# EAGLE design ECG (EAGLE 9.4.2)
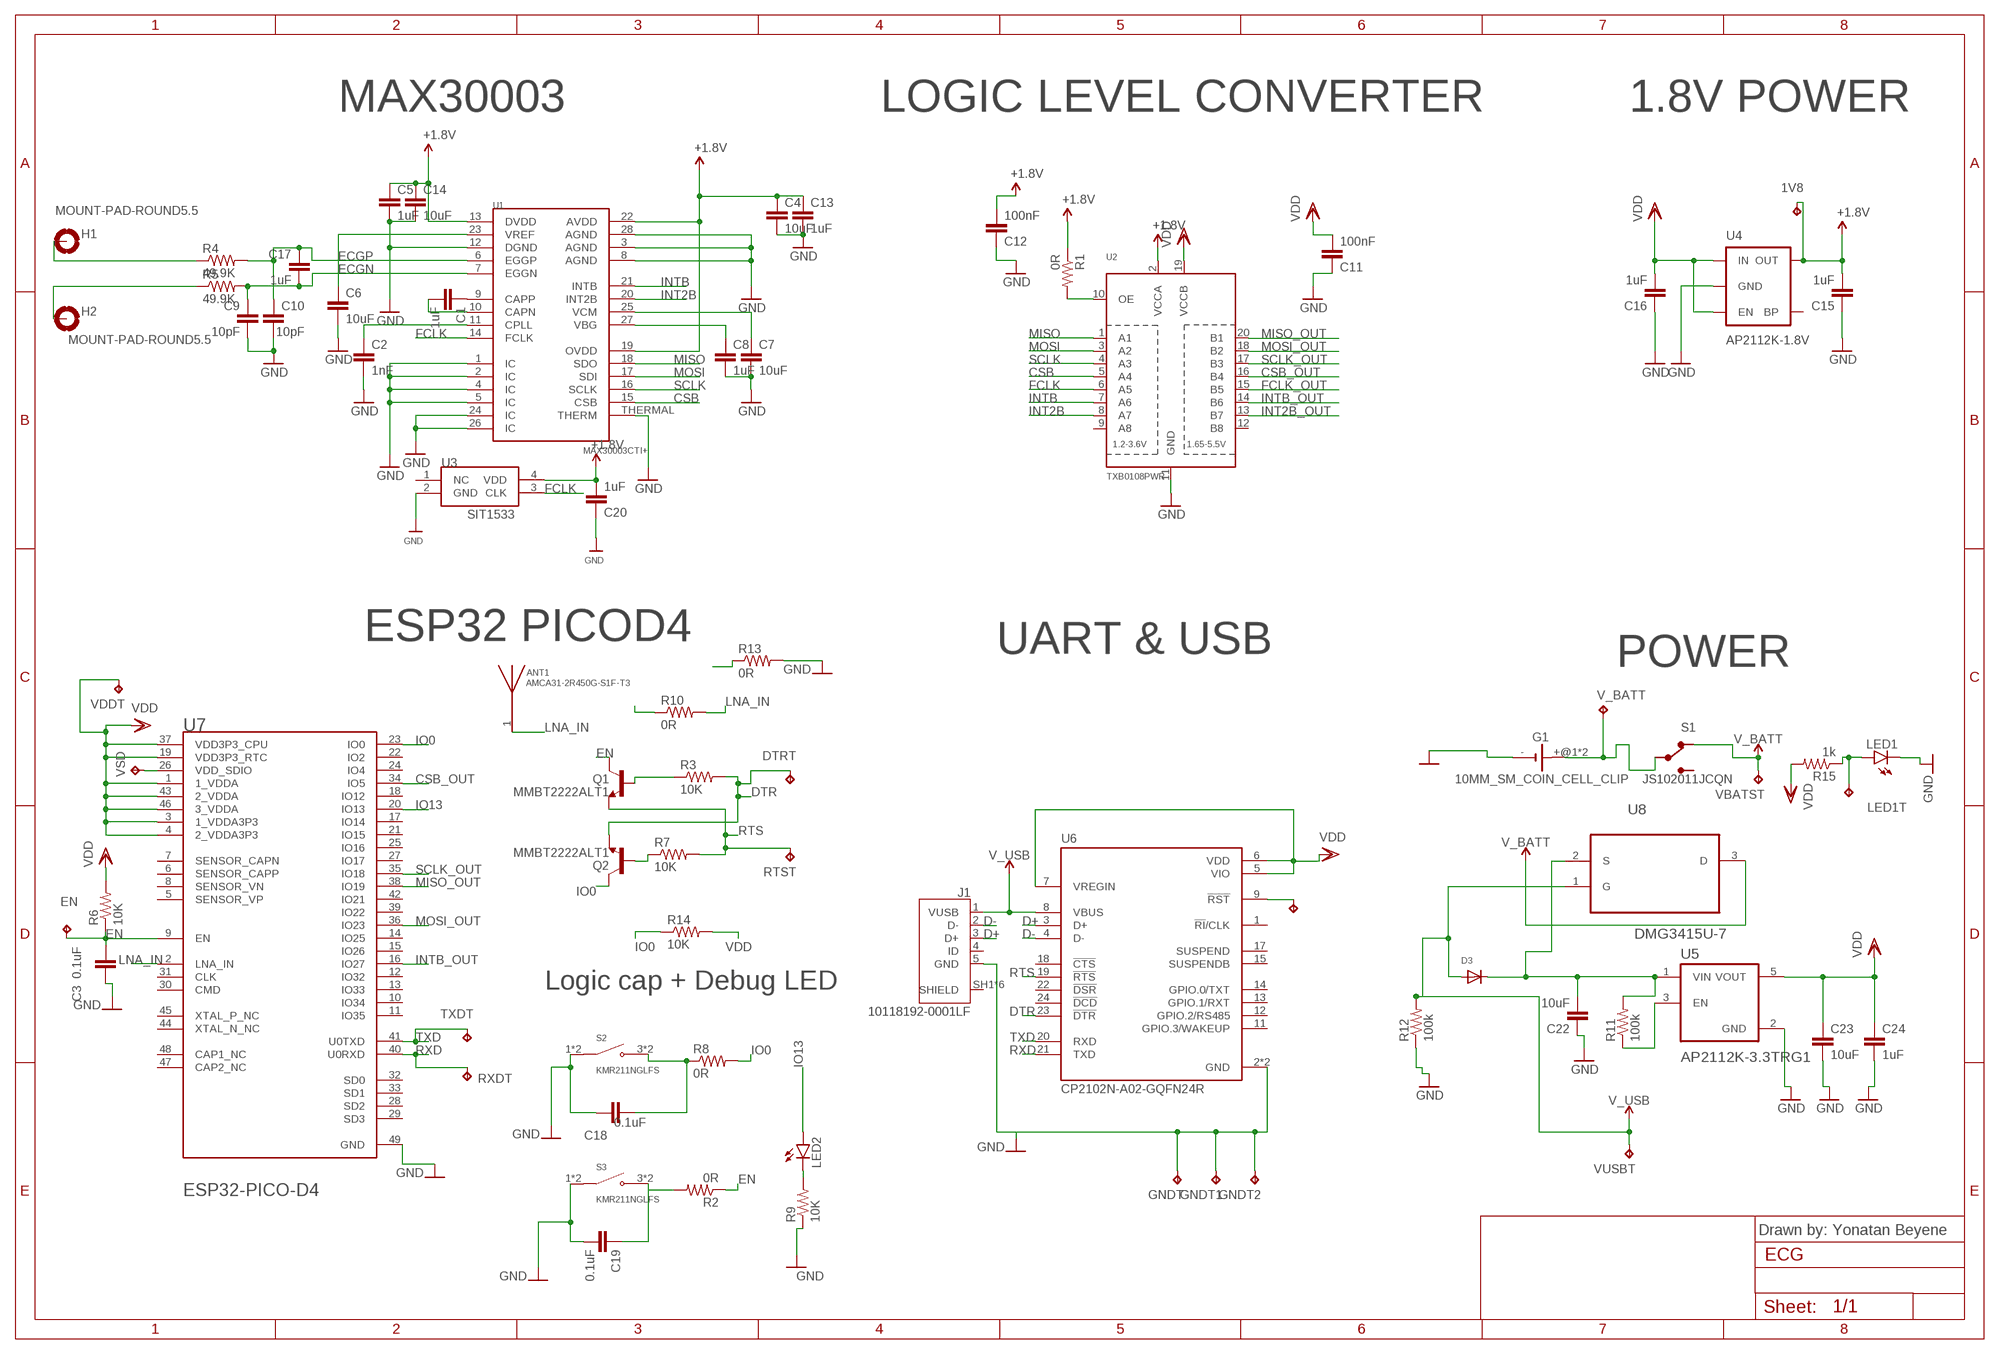
[diagram p0: schematic, sheet 1]

## Parts
1V8  TPTP12SQ  [TP12SQ]
ANT1  AMCA31-2R450G-S1F-T3  [ANT_AMCA31-2R450G-S1F-T3]
C1  1uF  C-EUC0805  [C0805]
C2  1nF  C-EUC0805  [C0805]
C3  0.1uF  C-EUC0805  [C0805]
C4  10uF  C-EUC0805  [C0805]
C5  1uF  C-EUC0805  [C0805]
C6  10uF  C-EUC0805  [C0805]
C7  10uF  C-EUC0805  [C0805]
C8  1uF  C-EUC0805  [C0805]
C9  10pF  C-EUC0805  [C0805]
C10  10pF  C-EUC0805  [C0805]
C11  100nF  C-EUC0805  [C0805]
C12  100nF  C-EUC0805  [C0805]
C13  1uF  C-EUC0805  [C0805]
C14  10uF  C-EUC0805  [C0805]
C15  1uF  C-EUC0805  [C0805]
C16  1uF  C-EUC0805  [C0805]
C17  1uF  C-EUC0805  [C0805]
C18  0.1uF  C-EUC0805  [C0805]
C19  0.1uF  C-EUC0805  [C0805]
C20  1uF  C-EUC0805  [C0805]
C22  10uF  C-EUC0805  [C0805]
C23  10uF  C-EUC0805  [C0805]
C24  1uF  C-EUC0805  [C0805]
D3  DIODE_SOD-123FL  [SOD-123FL]
DTRT  TPTP12SQ  [TP12SQ]
EN  TPTP12SQ  [TP12SQ]
G1  10MM_SM_COIN_CELL_CLIP  [10MM_SM_COIN_CELL_CLIP]
GNDT  TPTP12SQ  [TP12SQ]
GNDT1  TPTP12SQ  [TP12SQ]
GNDT2  TPTP12SQ  [TP12SQ]
H1  MOUNT-PAD-ROUND5.5  [5,5-PAD]
H2  MOUNT-PAD-ROUND5.5  [5,5-PAD]
J1  10118192-0001LF  [AMPHENOL_10118192-0001LF]
LED1  LEDSML0805  [SML0805]
LED1T  TPTP12SQ  [TP12SQ]
LED2  LEDSML0805  [SML0805]
Q1  MMBT2222ALT1  [SOT95P237X111-3N]
Q2  MMBT2222ALT1  [SOT95P237X111-3N]
R1  0R  RESISTOR0805-RES  [0805]
R2  0R  RESISTOR0805-RES  [0805]
R3  10K  RESISTOR0805-RES  [0805]
R4  49.9K  RESISTOR0805-RES  [0805]
R5  49.9K  RESISTOR0805-RES  [0805]
R6  10K  RESISTOR0805-RES  [0805]
R7  10K  RESISTOR0805-RES  [0805]
R8  0R  RESISTOR0805-RES  [0805]
R9  10K  RESISTOR0805-RES  [0805]
R10  0R  RESISTOR0805-RES  [0805]
R11  100k  RESISTOR0805-RES  [0805]
R12  100k  RESISTOR0805-RES  [0805]
R13  0R  RESISTOR0805-RES  [0805]
R14  10K  RESISTOR0805-RES  [0805]
R15  1k  RESISTOR0805-RES  [0805]
RTST  TPTP12SQ  [TP12SQ]
RXDT  TPTP12SQ  [TP12SQ]
S1  JS102011JCQN  [SW_JS102011JCQN]
S2  KMR211NGLFS  [SW_KMR211NGLFS]
S3  KMR211NGLFS  [SW_KMR211NGLFS]
TXDT  TPTP12SQ  [TP12SQ]
U1  MAX30003CTI+  MAX30003  [QFN-28]
U2  TXB0108PWR  [TSSOP20]
U3  SIT1533  [SIT1533]
U4  AP2112K-1.8V  V_REG_LDOSMD  [SOT23-5]
U5  AP2112K-3.3TRG1  [SOT95P285X140-5N]
U6  CP2102N-A02-GQFN24R  [QFN50P400X400X80-25N]
U7  ESPRESSIF_SYSTEMS_ESP32-PICO-D4ESPRESSIF_SYSTEMS_ESP32-PICO-D4_0_0  [ESPRESSIF_SYSTEMS_ESP32-PICO-D4_0]
U8  DMG3415U-7  [SOT95P240X105-3N]
URSTT  TPTP12SQ  [TP12SQ]
V_BATT  TPTP12SQ  [TP12SQ]
VBATST  TPTP12SQ  [TP12SQ]
VDDT  TPTP12SQ  [TP12SQ]
VSD  TPTP12SQ  [TP12SQ]
VUSBT  TPTP12SQ  [TP12SQ]

## Nets
+1.8V: 1V8.TP C4.1 C5.1 C12.2 C13.1 C14.1 C15.2 C20.2 R1.1 U1.13(DVDD) U1.19(OVDD) U1.22(AVDD) U2.2(VCCA) U3.4(VDD) U4.5(OUT)
CSB: U1.15(CSB) U2.5(A4)
CSB_OUT: U2.16(B4) U7.34(IO5)
D+: J1.3(D+) U6.3(D+)
D-: J1.2(D-) U6.4(D-)
DTR: DTRT.TP Q2.2(E) R3.2 U6.23(!DTR)
ECGN: C9.1 C17.2 R5.2 U1.7(EGGN)
ECGP: C10.1 C17.1 R4.2 U1.6(EGGP)
EN: C3.2 EN.TP Q1.3(C) R2.1 R6.1 U7.9(EN)
FCLK: U1.14(FCLK) U2.6(A5) U3.3(CLK)
FCLK_OUT: U2.15(B5)
GND: C2.2 C3.1 C4.2 C5.2 C6.2 C7.2 C8.2 C9.2 C10.2 C11.1 C12.1 C13.2 C14.2 C15.1 C16.1 C18.1 C19.2 C20.1 C22.1 C23.2 C24.2 G1.- GNDT1.TP GNDT2.TP GNDT.TP J1.5(GND) LED1.C R9.1 R12.1 R13.2 S2.1(COM) S2.2(COM) S3.1(COM) S3.2(COM) U1.1(IC) U1.2(IC) U1.3(AGND) U1.4(IC) U1.5(IC) U1.8(AGND) U1.12(DGND) U1.24(IC) U1.26(IC) U1.28(AGND) U1.THERMAL(THERM) U2.11(GND) U3.2(GND) U4.2(GND) U5.2(GND) U6.2(GND) U6.25(GND) U7.49(GND)
INT2B: U1.20(INT2B) U2.8(A7)
INT2B_OUT: U2.13(B7)
INTB: U1.21(INTB) U2.7(A6)
INTB_OUT: U2.14(B6) U7.16(IO27)
IO0: Q2.3(C) R8.2 R14.1 U7.23(IO0)
IO13: LED2.A U7.20(IO13)
LNA_IN: ANT1.1 R10.2 U7.2(LNA_IN)
MISO: U1.18(SDO) U2.1(A1)
MISO_OUT: U2.20(B1) U7.38(IO19)
MOSI: U1.17(SDI) U2.3(A2)
MOSI_OUT: U2.18(B2) U7.36(IO23)
N$1: H1.B5,5(MOUNT) R4.1
N$2: C6.1 U1.23(VREF)
N$3: C1.1 U1.9(CAPP)
N$4: H2.B5,5(MOUNT) R5.1
N$5: R1.2 U2.10(OE)
N$6: C1.2 U1.10(CAPN)
N$7: C2.1 U1.11(CPLL)
N$8: Q1.1(B) R3.1
N$9: U7.26(VDD_SDIO) VSD.TP
N$11: Q2.1(B) R7.1
N$12: R10.1
N$13: C18.2 R8.1 S2.3(NO) S2.4(NO)
N$14: C8.1 U1.27(VBG)
N$15: LED2.C R9.2
N$16: LED1.A LED1T.TP R15.1
N$17: U6.9(!RST) URSTT.TP
N$18: C19.1 R2.2 S3.3(NO) S3.4(NO)
N$20: R13.1
N$21: G1.+@1(+) G1.+@2(+) S1.2 V_BATT.TP
N$25: R11.1 U5.3(EN)
N$26: C22.2 D3.C R11.2 U5.1(VIN) U8.2(S)
RTS: Q1.2(E) R7.2 RTST.TP U6.19(!RTS)
RXD: RXDT.TP U6.21(TXD) U7.40(U0RXD)
SCLK: U1.16(SCLK) U2.4(A3)
SCLK_OUT: U2.17(B3) U7.35(IO18)
TXD: TXDT.TP U6.20(RXD) U7.41(U0TXD)
V_BATT: S1.1 U8.3(D) VBATST.TP
V_USB: D3.A J1.1(VUSB) R12.2 U6.8(VBUS) U8.1(G) VUSBT.TP
VCM: C7.1 U1.25(VCM)
VDD: C11.2 C16.2 C23.1 C24.1 R6.2 R14.2 R15.2 U2.19(VCCB) U4.1(IN) U4.3(EN) U5.5(VOUT) U6.5(VIO) U6.6(VDD) U6.7(VREGIN) U7.1(1_VDDA) U7.3(1_VDDA3P3) U7.4(2_VDDA3P3) U7.19(VDD3P3_RTC) U7.37(VDD3P3_CPU) U7.43(2_VDDA) U7.46(3_VDDA) VDDT.TP
Unconnected: J1.4(ID) J1.SH1(SHIELD) J1.SH2(SHIELD) J1.SH3(SHIELD) J1.SH4(SHIELD) J1.SH5(SHIELD) J1.SH6(SHIELD) S1.3 U2.9(A8) U2.12(B8) U3.1(NC) U4.4(BP) U6.1(!RI!/CLK) U6.11(GPIO.3/WAKEUP) U6.12(GPIO.2/RS485) U6.13(GPIO.1/RXT) U6.14(GPIO.0/TXT) U6.15(SUSPENDB) U6.17(SUSPEND) U6.18(!CTS) U6.22(!DSR) U6.24(!DCD) U7.5(SENSOR_VP) U7.6(SENSOR_CAPP) U7.7(SENSOR_CAPN) U7.8(SENSOR_VN) U7.10(IO34) U7.11(IO35) U7.12(IO32) U7.13(IO33) U7.14(IO25) U7.15(IO26) U7.17(IO14) U7.18(IO12) U7.21(IO15) U7.22(IO2) U7.24(IO4) U7.25(IO16) U7.27(IO17) U7.28(SD2) U7.29(SD3) U7.30(CMD) U7.31(CLK) U7.32(SD0) U7.33(SD1) U7.39(IO22) U7.42(IO21) U7.44(XTAL_N_NC) U7.45(XTAL_P_NC) U7.47(CAP2_NC) U7.48(CAP1_NC)

## Notes on the sheet
- MAX30003 | LOGIC LEVEL CONVERTER | 1.8V POWER
- ESP32 PICOD4 | UART & USB
- POWER
- Logic cap + Debug LED
- Drawn by: Yonatan Beyene

## Library data of the parts
1V8 DTRT EN GNDT GNDT1 GNDT2 LED1T RTST RXDT TXDT URSTT V_BATT VBATST VDDT VSD VUSBT = testpad:TP: Test pad
ANT1 = AMCA31-2R450G-S1F-T3:AMCA31-2R450G-S1F-T3: Surface Mount WLAN / Bluetooth Chip Antenna (2450MHz) Check prices <https://pricing.snapeda.com/parts/AMCA31-2R450G-S1F-T3/Abracon%20LLC/view-part?ref=eda>; AVAILABILITY: Good; DESCRIPTION: 2.4GHz Bluetooth, Wi-Fi, WLAN Chip RF Antenna 2.405GHz ~ 2.495GHz 0.5dBi Solder Surface Mount; MF: Abracon LLC; MP: AMCA31-2R450G-S1F-T3; PACKAGE: None; PRICE: None; PURCHASE-URL: https://pricing.snapeda.com/search/part/AMCA31-2R450G-S1F-T3/?ref=eda
C1 C2 C4-C17 C20 = rcl:C-EU: CAPACITOR, European symbol; SPICEPREFIX: C
C3 C18 C19 C22-C24 = rcl:C-EU: CAPACITOR, European symbol
D3 = adafruit:DIODE: Diode SMADIODE - SMA Surface Mount Package 20V 1A Schottky Diode Digikey: 641-1014-6-ND DO-1N4148 - Through Hole Small Current Diode SOD-123 20V 1 A (.5mV Vf) Schottky Diode - Digikey: MBRX120TPMSCT-ND SOD-323 10V 570mA (.38mV Vf, 3ns) Schottky Diode - Digikey: ZLLS410CT-ND SOD-523 30V 30mA Schottky Diode (RB751S-40TE61) - Digikey: RB751S-40TE61CT-ND SOT23-R/W - SOT23 Package (R = Solder Paste/Reflow Ovens, W = Hand-Soldering) BAT54Film 40V 300mA - Digikey: 497-7162-1-ND
G1 = battery:10MM_SM_COIN_CELL_CLIP: Battery cell clip for CR927 Source: KEYSTONE ELECTRONICS CORP. www.keyelco.com, ASTORIA, N.Y. 11105-2017 PART ANME 10mm SM COIN CELl CLIP DWG NO. 3030
H1 H2 = holes:MOUNT-PAD-ROUND: MOUNTING PAD, round
J1 = 10118192-0001LF:10118192-0001LF: Single Port 5 Contact Horizontal Right Angle Shielded Micro B USB 2.0 Connector Check prices <https://pricing.snapeda.com/parts/10118192-0001LF/Amphenol%20ICC%20%28FCI%29/view-part?ref=eda>; AVAILABILITY: Good; DESCRIPTION: USB - micro B USB 2.0 Receptacle Connector 5 Position Surface Mount, Right Angle; MF: Amphenol ICC (FCI); MP: 10118192-0001LF; PACKAGE: None; PRICE: None; PURCHASE-URL: https://pricing.snapeda.com/search/part/10118192-0001LF/?ref=eda
LED1 LED2 = led:LED: LED OSRAM: - CHIPLED LG R971, LG N971, LY N971, LG Q971, LY Q971, LO R971, LY R971 LH N974, LH R974 LS Q976, LO Q976, LY Q976 LO Q996 - Hyper CHIPLED LW Q18S LB Q993, LB Q99A, LB R99A - SideLED LS A670, LO A670, LY A670, LG A670, LP A670 LB A673, LV A673, LT A673, LW A673 LH A674 LY A675 LS A676, LA A676, LO A676, LY A676, LW A676 LS A679, LY A679, LG A679 - Hyper Micro SIDELED® LS Y876, LA Y876, LO Y876, LY Y876 LT Y87S - SmartLED LW L88C, LW L88S LB L89C, LB L89S, LG L890 LS L89K, LO L89K, LY L89K LS L896, LA L896, LO L896, LY L896 - TOPLED LS T670, LO T670, LY T670, LG T670, LP T670 LSG T670, LSP T670, LSY T670, LOP T670, LYG T670 LG T671, LOG T671, LSG T671 LB T673, LV T673, LT T673, LW T673 LH T674 LS T676, LA T676, LO T676, LY T676, LB T676, LH T676, LSB T676, LW T676 LB T67C, LV T67C, LT T67C, LS T67K, LO T67K, LY T67K, LW E67C LS E67B, LA E67B, LO E67B, LY E67B, LB E67C, LV E67C, LT E67C LW T67C LS T679, LY T679, LG T679 LS T770, LO T770, LY T770, LG T770, LP T770 LB T773, LV T773, LT T773, LW T773 LH T774 LS E675, LA E675, LY E675, LS T675 LS T776, LA T776, LO T776, LY T776, LB T776 LHGB T686 LT T68C, LB T68C - Hyper Mini TOPLED® LB M676 - Mini TOPLED Santana® LG M470 LS M47K, LO M47K, LY M47K Source: http://www.osram.convergy.de LUXEON: - LUMILED® LXK2-PW12-R00, LXK2-PW12-S00, LXK2-PW14-U00, LXK2-PW14-V00 LXK2-PM12-R00, LXK2-PM12-S00, LXK2-PM14-U00 LXK2-PE12-Q00, LXK2-PE12-R00, LXK2-PE12-S00, LXK2-PE14-T00, LXK2-PE14-U00 LXK2-PB12-K00, LXK2-PB12-L00, LXK2-PB12-M00, LXK2-PB14-N00, LXK2-PB14-P00, LXK2-PB14-Q00 LXK2-PR12-L00, LXK2-PR12-M00, LXK2-PR14-Q00, LXK2-PR14-R00 LXK2-PD12-Q00, LXK2-PD12-R00, LXK2-PD12-S00 LXK2-PH12-R00, LXK2-PH12-S00 LXK2-PL12-P00, LXK2-PL12-Q00, LXK2-PL12-R00 Source: www.luxeon.com KINGBRIGHT: KA-3528ASYC Source: www.kingbright.com
Q1 Q2 = MMBT2222ALT1:MMBT2222ALT1: Trans NPN 40V 0.6A SOT23; AVAILABILITY: Unavailable; DESCRIPTION: Bipolar (BJT) Transistor NPN 40V 600mA 300MHz 225mW Surface Mount SOT-23; MF: ON Semiconductor; MP: MMBT2222ALT1; PACKAGE: SOT-23-3 ON Semiconductor; PRICE: None
R1-R15 = SparkFun:RESISTOR: Resistor Basic schematic elements and footprints for 0603, 1206, and PTH resistors.
S1 = JS102011JCQN:JS102011JCQN: Switch Slide Spdt 300ma 6v Check prices <https://pricing.snapeda.com/parts/JS102011JCQN/C%26K/view-part?ref=eda>; AVAILABILITY: Good; DESCRIPTION: Slide Switch SPDT Surface Mount; MF: C&K; MP: JS102011JCQN; PACKAGE: None; PRICE: None; PURCHASE-URL: https://pricing.snapeda.com/search/part/JS102011JCQN/?ref=eda
S2 S3 = KMR211NGLFS:KMR211NGLFS: Tactile Switch SPST-NO Top Actuated Surface Mount Check prices <https://pricing.snapeda.com/parts/KMR211NGLFS/C%26K%20Components/view-part?ref=eda>; AVAILABILITY: Good; DESCRIPTION: Tactile Switch SPST-NO Top Actuated Surface Mount; MF: C&K Components; MP: KMR211NGLFS; PACKAGE: None; PRICE: None; PURCHASE-URL: https://pricing.snapeda.com/search/part/KMR211NGLFS/?ref=eda
U1 = circuitects:MAX30003
U2 = adafruit:TXB0108PWR: 8-Bit Bi-Directional Level Shifter 1.2V-3.6V (VCCA) to 1.65V-5.5V (VCCB) bi-directional level shifter with auto direction sensing. Max data rate - VCCA 1.8V: 20Mbps (50ns), VCCA 3.3V: 100Mbps (10ns) Digikey: 296-21527-1-ND
U3 = circuitects:SIT1533
U4 = SparkFun-PowerIC:V_REG_LDO: Voltage Regulator LDO Standard 150mA LDO voltage regulator in SOT-23 layout. Micrel part MIC5205. BP (by-pass) pin is used to lower output noise with 470pF cap.; PROD_ID: VREG-12457
U5 = AP2112K-3.3TRG1:AP2112K-3.3TRG1: AP2112 Series 0.6 A 3.3 V Fixed Output SMT LDO Linear Regulator - SOT23-5 Check prices <https://pricing.snapeda.com/parts/AP2112K-3.3TRG1/Diodes%20Zetex/view-part?ref=eda>; AVAILABILITY: Warning; DESCRIPTION: LDO Regulator Pos 3.3V 0.6A 5-Pin SOT-23 T/R; MF: Diodes Zetex; MP: AP2112K-3.3TRG1; PACKAGE: None; PRICE: None; PURCHASE-URL: https://pricing.snapeda.com/search/part/AP2112K-3.3TRG1/?ref=eda
U6 = CP2102N-A02-GQFN24R:CP2102N-A02-GQFN24R: Check prices <https://pricing.snapeda.com/parts/CP2102N-A02-GQFN24R/Silicon%20Labs/view-part?ref=eda>; AVAILABILITY: Warning; DESCRIPTION: IC USB TO UART BRIDGE QFN24; MF: Silicon Labs; MP: CP2102N-A02-GQFN24R; PACKAGE: WFQFN-24 Silicon Labs; PRICE: None; PURCHASE-URL: https://pricing.snapeda.com/search/part/CP2102N-A02-GQFN24R/?ref=eda
U7 = Espressif Systems - ESP32-PICO-D4:ESPRESSIF_SYSTEMS_ESP32-PICO-D4: Bluetooth, WiFi 802.11b/g/n, Bluetooth v4.2 + EDR, Class 1, 2 and 3 Transceiver Module 2.4GHz ~ 2.5GHz Surface Mount; AUTOMOTIVE: No; BANDWIDTH: 72MHz; CENTROID_NOT_SPECIFIED: No; DATASHEET: https://www.espressif.com/sites/default/files/documentation/esp32-pico-d4_datasheet_en.pdf; DATA_RATE: 150Mbits/s; DEVICE_CLASS_L1: Integrated Circuits (ICs); DEVICE_CLASS_L2: RF Semiconductors and Devices; DEVICE_CLASS_L3: Transceivers; DIGIKEY_DESCRIPTION: RX TXRX MOD WIFI SURFACE MOUNT; DIGIKEY_PART_NUMBER: 1904-1029-1-ND; FOOTPRINT_PARAMETERS_0: {"fp_type":"QFN","params":{"N1":{"nom":12,"long name":"Leads on long side","min":null,"max":null,"short name":"N1","type":"count"},"N2":{"nom":12,"long name":"Leads on wide side","min":null,"max":null,"short name":"N2","type":"count"},"A":{"nom":940000,"long name":"Height","min":840000,"max":1040000,"short name":"A","type":"measurement"},"A1":{"nom":false,"long name":"Package clearance","min":0,"max":50000,"short name":"A1","type":"measurement"},"A2":{"nom":false,"long name":"Package height","min":false,"max":1040000,"short name":"A2","type":"measurement"},"D":{"nom":7000000,"long name":"Package length","min":6900000,"max":7100000,"short name":"D","type":"measurement"},"E":{"nom":7000000,"long name":"Package width","min":6900000,"max":7100000,"short name":"E","type":"measurement"},"B":{"nom":250000,"long name":"Lead width","min":200000,"max":300000,"short name":"B","type":"measurement"},"C":{"nom":260000,"long name":"Lead thickness","min":null,"max":null,"short name":"C","type":"measurement"},"L":{"nom":400000,"long name":"Lead foot length","min":325000,"max":475000,"short name":"L","type":"measurement"},"e":{"nom":500000,"long name":"Lead pitch","min":null,"max":null,"short name":"e","type":"measurement"},"D2":{"nom":5400000,"long name":"Thermal pad length","min":5300000,"max":5500000,"short name":"D2","type":"measurement"},"E2":{"nom":5400000,"long name":"Thermal pad width","min":5300000,"max":5500000,"short name":"E2","type":"measurement"},"PC":{"long name":"Paste coverage (%)","type":"percentage","short name":"PC","value":40},"HT":{"default":"Yes","long name":"Thermal pad","type":"multichoiceparent","short name":"HT","children":["D2","E2","PC"]},"offset x":{"nom":0,"long name":"X Center offset","min":null,"max":null,"short name":"offset x","type":"measurement"},"offset y":{"nom":0,"long name":"Y Center offset","min":null,"max":null,"short name":"offset y","type":"measurement"},"LS":{"default":"Rounded rectangle","long name":"Land shape","type":"multichoice","short name":"LS"},"LS1":{"default":"Rectangle","long name":"Land shape (Pin 1)","type":"multichoice","short name":"LS1"},"solder toe":{"nom":400000,"long name":"Solder fillet (toe)","min":null,"max":null,"short name":"solder toe","type":"fixedmeasurement"},"solder heel":{"nom":0,"long name":"Solder fillet (heel)","min":null,"max":null,"short name":"solder heel","type":"fixedmeasurement"},"solder side":{"nom":-40000,"long name":"Solder fillet (side)","min":null,"max":null,"short name":"solder side","type":"fixedmeasurement"},"courtyard":{"nom":500000,"long name":"Courtyard","min":null,"max":null,"short name":"courtyard","type":"fixedmeasurement"},"SF":{"default":"A","long name":"Packing level","type":"multichoiceparent","short name":"SF","help":"http://support.upverter.com/customer/portal/articles/978783-what-is-a-footprint-packing-level","children":["solder toe","solder heel","solder side","courtyard"]}}}; FOOTPRINT_PARAMETERS_1: {"fp_type":"QFN","params":{"N1":{"nom":12,"long name":"Leads on long side","min":null,"max":null,"short name":"N1","type":"count"},"N2":{"nom":12,"long name":"Leads on wide side","min":null,"max":null,"short name":"N2","type":"count"},"A":{"nom":940000,"long name":"Height","min":840000,"max":1040000,"short name":"A","type":"measurement"},"A1":{"nom":false,"long name":"Package clearance","min":0,"max":50000,"short name":"A1","type":"measurement"},"A2":{"nom":false,"long name":"Package height","min":false,"max":1040000,"short name":"A2","type":"measurement"},"D":{"nom":7000000,"long name":"Package length","min":6900000,"max":7100000,"short name":"D","type":"measurement"},"E":{"nom":7000000,"long name":"Package width","min":6900000,"max":7100000,"short name":"E","type":"measurement"},"B":{"nom":250000,"long name":"Lead width","min":200000,"max":300000,"short name":"B","type":"measurement"},"C":{"nom":260000,"long name":"Lead thickness","min":null,"max":null,"short name":"C","type":"measurement"},"L":{"nom":400000,"long name":"Lead foot length","min":325000,"max":475000,"short name":"L","type":"measurement"},"e":{"nom":500000,"long name":"Lead pitch","min":null,"max":null,"short name":"e","type":"measurement"},"D2":{"nom":5400000,"long name":"Thermal pad length","min":5300000,"max":5500000,"short name":"D2","type":"measurement"},"E2":{"nom":5400000,"long name":"Thermal pad width","min":5300000,"max":5500000,"short name":"E2","type":"measurement"},"PC":{"long name":"Paste coverage (%)","type":"percentage","short name":"PC","value":40},"HT":{"default":"Yes","long name":"Thermal pad","type":"multichoiceparent","short name":"HT","children":["D2","E2","PC"]},"offset x":{"nom":0,"long name":"X Center offset","min":null,"max":null,"short name":"offset x","type":"measurement"},"offset y":{"nom":0,"long name":"Y Center offset","min":null,"max":null,"short name":"offset y","type":"measurement"},"LS":{"default":"Rounded rectangle","long name":"Land shape","type":"multichoice","short name":"LS"},"LS1":{"default":"Rectangle","long name":"Land shape (Pin 1)","type":"multichoice","short name":"LS1"},"solder toe":{"nom":300000,"long name":"Solder fillet (toe)","min":null,"max":null,"short name":"solder toe","type":"fixedmeasurement"},"solder heel":{"nom":0,"long name":"Solder fillet (heel)","min":null,"max":null,"short name":"solder heel","type":"fixedmeasurement"},"solder side":{"nom":-40000,"long name":"Solder fillet (side)","min":null,"max":null,"short name":"solder side","type":"fixedmeasurement"},"courtyard":{"nom":250000,"long name":"Courtyard","min":null,"max":null,"short name":"courtyard","type":"fixedmeasurement"},"SF":{"default":"B","long name":"Packing level","type":"multichoiceparent","short name":"SF","help":"http://support.upverter.com/customer/portal/articles/978783-what-is-a-footprint-packing-level","children":["solder toe","solder heel","solder side","courtyard"]}}}; FOOTPRINT_PARAMETERS_2: {"fp_type":"QFN","params":{"N1":{"nom":12,"long name":"Leads on long side","min":null,"max":null,"short name":"N1","type":"count"},"N2":{"nom":12,"long name":"Leads on wide side","min":null,"max":null,"short name":"N2","type":"count"},"A":{"nom":940000,"long name":"Height","min":840000,"max":1040000,"short name":"A","type":"measurement"},"A1":{"nom":false,"long name":"Package clearance","min":0,"max":50000,"short name":"A1","type":"measurement"},"A2":{"nom":false,"long name":"Package height","min":false,"max":1040000,"short name":"A2","type":"measurement"},"D":{"nom":7000000,"long name":"Package length","min":6900000,"max":7100000,"short name":"D","type":"measurement"},"E":{"nom":7000000,"long name":"Package width","min":6900000,"max":7100000,"short name":"E","type":"measurement"},"B":{"nom":250000,"long name":"Lead width","min":200000,"max":300000,"short name":"B","type":"measurement"},"C":{"nom":260000,"long name":"Lead thickness","min":null,"max":null,"short name":"C","type":"measurement"},"L":{"nom":400000,"long name":"Lead foot length","min":325000,"max":475000,"short name":"L","type":"measurement"},"e":{"nom":500000,"long name":"Lead pitch","min":null,"max":null,"short name":"e","type":"measurement"},"D2":{"nom":5400000,"long name":"Thermal pad length","min":5300000,"max":5500000,"short name":"D2","type":"measurement"},"E2":{"nom":5400000,"long name":"Thermal pad width","min":5300000,"max":5500000,"short name":"E2","type":"measurement"},"PC":{"long name":"Paste coverage (%)","type":"percentage","short name":"PC","value":40},"HT":{"default":"Yes","long name":"Thermal pad","type":"multichoiceparent","short name":"HT","children":["D2","E2","PC"]},"offset x":{"nom":0,"long name":"X Center offset","min":null,"max":null,"short name":"offset x","type":"measurement"},"offset y":{"nom":0,"long name":"Y Center offset","min":null,"max":null,"short name":"offset y","type":"measurement"},"LS":{"default":"Rounded rectangle","long name":"Land shape","type":"multichoice","short name":"LS"},"LS1":{"default":"Rectangle","long name":"Land shape (Pin 1)","type":"multichoice","short name":"LS1"},"solder toe":{"nom":200000,"long name":"Solder fillet (toe)","min":null,"max":null,"short name":"solder toe","type":"fixedmeasurement"},"solder heel":{"nom":0,"long name":"Solder fillet (heel)","min":null,"max":null,"short name":"solder heel","type":"fixedmeasurement"},"solder side":{"nom":-40000,"long name":"Solder fillet (side)","min":null,"max":null,"short name":"solder side","type":"fixedmeasurement"},"courtyard":{"nom":100000,"long name":"Courtyard","min":null,"max":null,"short name":"courtyard","type":"fixedmeasurement"},"SF":{"default":"C","long name":"Packing level","type":"multichoiceparent","short name":"SF","help":"http://support.upverter.com/customer/portal/articles/978783-what-is-a-footprint-packing-level","children":["solder toe","solder heel","solder side","courtyard"]}}}; FOOTPRINT_VARIANT_NAME_0: IPC_A; FOOTPRINT_VARIANT_NAME_1: IPC_B; FOOTPRINT_VARIANT_NAME_2: IPC_C; HEIGHT: 1.04mm; INTERFACE: I2C,SPI,UART,I2S,Other; IPC_LAND_PATTERN_NAME: QFN50P700X700X94-48; LEAD_FREE: Yes; MAX_FREQUENCY: 2484MHz; MAX_SUPPLY_VOLTAGE: 3.6V; MF: Espressif Systems; MFG_PACKAGE_IDENT: 0; MFG_PACKAGE_IDENT_DATE: 0; MFG_PACKAGE_IDENT_REV: 0; MIN_SUPPLY_VOLTAGE: 3V; MOUSER_PART_NUMBER: 356-ESP32-PICO-D4; MPN: ESP32-PICO-D4; NOMINAL_SUPPLY_CURRENT: 0.5A; NUMBER_OF_ADC_CHANNELS: 18; NUMBER_OF_GPIO: 23; PACKAGE: QFN48; PREFIX: U; ROHS: Yes; SENSITIVITY: -97dBm; TEMPERATURE_RANGE_HIGH: +85°C; TEMPERATURE_RANGE_LOW: -40°C; VERIFICATION_VERSION: 0.0.0.3
U8 = DMG3415U-7:DMG3415U-7: P-CHANNEL ENHANCEMENT MODE MOSFET Check prices <https://pricing.snapeda.com/parts/DMG3415U-7/Diodes%20Inc./view-part?ref=eda>; AVAILABILITY: Good; DESCRIPTION: P-Channel 20V 4A (Ta) 900mW (Ta) Surface Mount SOT-23-3; MF: Diodes Inc.; MP: DMG3415U-7; PACKAGE: SOT-23 Multicomp; PRICE: None; PURCHASE-URL: https://pricing.snapeda.com/search/part/DMG3415U-7/?ref=eda

## Board
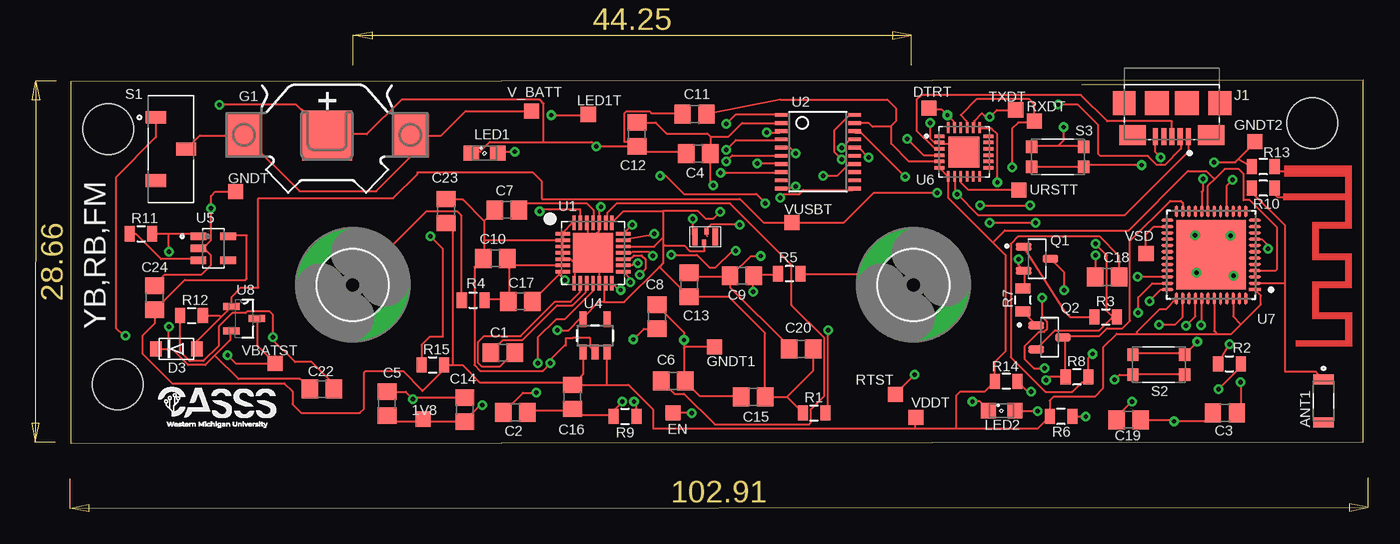
[diagram p1: board, top side]
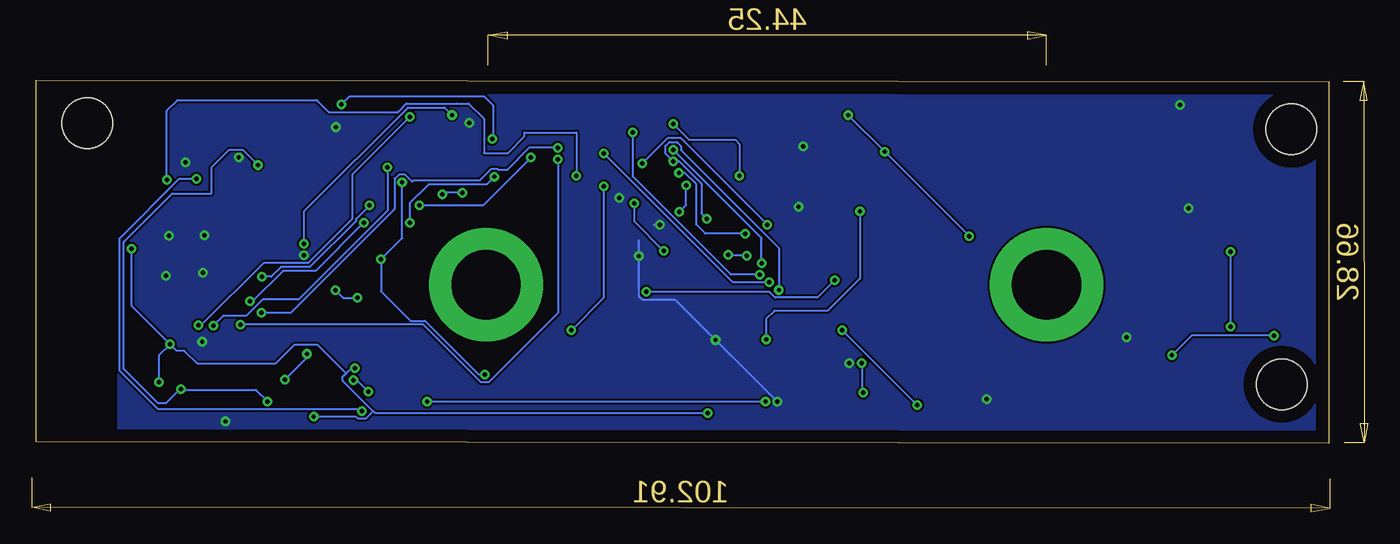
[diagram p2: board, bottom side, seen from below]

Size 102.47 x 28.79 mm. Coordinates in mm from the lower left corner, seen from the top.
Outline: 0,0 102.46,0.1 102.47,28.79 0.01,28.69 0,0
Copper layers (1*16): Top 0.035mm / dielectric 1.5mm / Bottom 0.035mm
Design rules "default": minimum track width 6mil, minimum drill 0.35mm, track to track 6mil, track to pad 6mil, pad to pad 6mil, via to via 6mil, smd to smd 6mil, copper to edge 40mil, drill to drill 6mil, minimum pad ring 10mil, minimum via ring 8mil, stop-mask expansion 4mil, vias tented up to drill 0mil, thermal gap 10mil
Holes 4.01 mm at 98.44,25.4 2.96,24.9 3.74,4.69

### Footprints (pad centres in the part's own frame; a part is rotated, then mirrored left to right if it is on the bottom)
TP12SQ = smd 1.2 x 1.2: TP 0,0
ANT_AMCA31-2R450G-S1F-T3 = smd 0.8 x 1.6: 1 -1.7,0; 2 1.7,0
C0805 = smd 1.3 x 1.5: 1 -0.95,0; 2 0.95,0
SOD-123FL = smd 0.91 x 1.22: A 1.637,0; C -1.637,0
10MM_SM_COIN_CELL_CLIP = smd 2.9 x 3.5: +@1 -6.6,0; +@2 6.6,0 | smd 3.96 x 3.96: - 0,0
5,5-PAD = drill 5.5 pad 9: B5,5 0,0
AMPHENOL_10118192-0001LF = smd 0.4 x 1.35: 1 -1.3,0; 2 -0.65,0; 3 0,0; 4 0.65,0; 5 1.3,0 | smd 2.1 x 1.6: SH1 -3.1,-0.125; SH2 3.1,-0.125 | smd 1.8 x 1.9: SH3 -3.8,-2.675; SH6 3.8,-2.675 | smd 1.9 x 1.9: SH4 -1.2,-2.675; SH5 1.2,-2.675
SML0805 = smd 1.2 x 1.2: A 1.05,0; C -1.05,0
SOT95P237X111-3N = smd 1.23 x 0.6: 1 -1.06,0.95; 2 -1.06,-0.95; 3 1.06,0
0805 = smd 0.8 x 1.2: 1 -0.9,0; 2 0.9,0
SW_JS102011JCQN = smd 1 x 1.6: 1 -2.5,-1.2; 2 0,1.2; 3 2.5,-1.2
SW_KMR211NGLFS = smd 0.9 x 1: 1 -2.05,0.8; 2 2.05,0.8; 3 -2.05,-0.8; 4 2.05,-0.8
QFN-28 = smd 1.15 x 0.27: 1 -2.4,1.5; 2 -2.4,1; 3 -2.4,0.5; 4 -2.4,0; 5 -2.4,-0.5; 6 -2.4,-1; 7 -2.4,-1.5; 15 2.4,-1.5; 16 2.4,-1; 17 2.4,-0.5; 18 2.4,0; 19 2.4,0.5; 20 2.4,1; 21 2.4,1.5 | smd 0.27 x 1.15: 8 -1.5,-2.4; 9 -1,-2.4; 10 -0.5,-2.4; 11 0,-2.4; 12 0.5,-2.4; 13 1,-2.4; 14 1.5,-2.4; 22 1.5,2.4; 23 1,2.4; 24 0.5,2.4; 25 0,2.4; 26 -0.5,2.4; 27 -1,2.4; 28 -1.5,2.4 | smd 3.15 x 3.15: THERMAL 0,0
TSSOP20 = smd 0.305 x 0.991: 1 -2.925,-2.918; 2 -2.275,-2.918; 3 -1.625,-2.918; 4 -0.975,-2.918; 5 -0.325,-2.918; 6 0.325,-2.918; 7 0.975,-2.918; 8 1.625,-2.918; 9 2.275,-2.918; 10 2.925,-2.918; 11 2.925,2.918; 12 2.275,2.918; 13 1.625,2.918; 14 0.975,2.918; 15 0.325,2.918; 16 -0.325,2.918; 17 -0.975,2.918; 18 -1.625,2.918; 19 -2.275,2.918; 20 -2.925,2.918
SIT1533 = smd 0.4 x 1.4: 1 -0.8,0; 3 0.8,0 | smd 0.3 x 0.5: 2 -0.1,-0.45; 4 0.1,0.45
SOT23-5 = smd 0.55 x 1.2: 1 -0.95,-1.3; 2 0,-1.3; 3 0.95,-1.3; 4 0.95,1.3; 5 -0.95,1.3
SOT95P285X140-5N = smd 1.35 x 0.6: 1 -1.185,0.95; 2 -1.185,0; 3 -1.185,-0.95; 4 1.185,-0.95; 5 1.185,0.95
QFN50P400X400X80-25N = smd 0.84 x 0.26: 1 -1.935,1.25; 2 -1.935,0.75; 3 -1.935,0.25; 4 -1.935,-0.25; 5 -1.935,-0.75; 6 -1.935,-1.25; 13 1.935,-1.25; 14 1.935,-0.75; 15 1.935,-0.25; 16 1.935,0.25; 17 1.935,0.75; 18 1.935,1.25 | smd 0.26 x 0.84: 7 -1.25,-1.935; 8 -0.75,-1.935; 9 -0.25,-1.935; 10 0.25,-1.935; 11 0.75,-1.935; 12 1.25,-1.935; 19 1.25,1.935; 20 0.75,1.935; 21 0.25,1.935; 22 -0.25,1.935; 23 -0.75,1.935; 24 -1.25,1.935 | smd 2.45 x 2.45: 25 0,0
ESPRESSIF_SYSTEMS_ESP32-PICO-D4_0 = smd 0.985 x 0.242: 1 -3.463,2.75; 2 -3.463,2.25; 3 -3.463,1.75; 4 -3.463,1.25; 5 -3.463,0.75; 6 -3.463,0.25; 7 -3.463,-0.25; 8 -3.463,-0.75; 9 -3.463,-1.25; 10 -3.463,-1.75; 11 -3.463,-2.25; 12 -3.463,-2.75; 25 3.463,-2.75; 26 3.463,-2.25; 27 3.463,-1.75; 28 3.463,-1.25; 29 3.463,-0.75; 30 3.463,-0.25; 31 3.463,0.25; 32 3.463,0.75; 33 3.463,1.25; 34 3.463,1.75; 35 3.463,2.25; 36 3.463,2.75 | smd 0.242 x 0.985: 13 -2.75,-3.463; 14 -2.25,-3.463; 15 -1.75,-3.463; 16 -1.25,-3.463; 17 -0.75,-3.463; 18 -0.25,-3.463; 19 0.25,-3.463; 20 0.75,-3.463; 21 1.25,-3.463; 22 1.75,-3.463; 23 2.25,-3.463; 24 2.75,-3.463; 37 2.75,3.463; 38 2.25,3.463; 39 1.75,3.463; 40 1.25,3.463; 41 0.75,3.463; 42 0.25,3.463; 43 -0.25,3.463; 44 -0.75,3.463; 45 -1.25,3.463; 46 -1.75,3.463; 47 -2.25,3.463; 48 -2.75,3.463 | smd 5.5 x 5.5: 49 0,0
SOT95P240X105-3N = smd 1.321 x 0.559: 1 -1.016,0.965; 2 -1.016,-0.965; 3 1.016,0

### Placement (x,y rotation side)
1V8  27.94,1.91 0 top
ANT1  99.32,3.37 270 top
C1  34.25,7.19 180 top
C2  35.24,2.45 0 top
C3  91.49,2.41 0 top
C4  49.76,22.98 180 top
C5  25.08,3.13 90 top
C6  47.76,4.95 0 top
C7  34.57,18.51 180 top
C8  46.49,10.02 90 top
C9  53.21,13.29 180 top
C10  33.66,14.67 180 top
C11  49.46,26.1 0 top
C12  44.89,24.5 90 top
C13  49.03,12.57 90 top
C14  31.25,2.68 90 top
C15  54.11,3.68 0 top
C16  39.78,3.68 90 top
C17  35.65,11.26 0 top
C18  82.15,13.19 0 top
C19  83.86,1.87 0 top
C20  57.92,7.48 0 top
C22  19.92,4.3 180 top
C23  29.76,18.42 90 top
C24  6.67,11.53 90 top
D3  8.39,7.48 0 top
DTRT  68.04,26.59 0 top
EN  47.76,2.4 0 top
G1  20.33,24.41 0 top
GNDT  13.09,19.96 0 top
GNDT1  51.03,7.66 0 top
GNDT2  93.87,23.94 0 top
H1  22.36,12.57 0 top
H2  66.81,12.57 0 top
J1  87.3,24.31 180 top
LED1  32.82,23.01 0 top
LED1T  41.04,26.08 0 top
LED2  73.8,2.59 0 top
Q1  76.61,14.64 0 top
Q2  77.6,8.4 0 top
R1  58.94,2.4 0 top
R2  91.85,6.31 0 top
R3  82.05,10.02 0 top
R4  31.91,11.35 0 top
R5  56.97,13.45 180 top
R6  78.51,2.14 180 top
R7  75.48,11.37 90 top
R8  79.77,5.26 180 top
R9  43.94,2.14 0 top
R10  94.53,20.23 180 top
R11  5.58,16.62 0 top
R12  9.59,10.13 0 top
R13  94.53,21.95 180 top
R14  74.16,4.92 180 top
R15  28.71,6.21 0 top
RTST  65.37,3.87 0 top
RXDT  76.39,25.56 0 top
S1  7.96,23.33 270 top
S2  86.25,6.24 0 top
S3  78.24,22.73 0 top
TXDT  74.91,26.44 0 top
U1  41.41,15.1 0 top
U2  59.23,23.13 270 top
U3  50.3,16.37 180 top
U4  41.57,8.54 0 top
U5  11.32,15.47 0 top
U6  70.81,23.1 0 top
U7  90.4,14.94 180 top
U8  13.76,9.88 0 top
URSTT  75.17,20.08 0 top
V_BATT  36.53,26.35 0 top
VBATST  16.2,6.32 0 top
VDDT  67,2.05 0 top
VSD  85.25,15.04 0 top
VUSBT  57.17,17.5 0 top

### Tracks (layer width: path | path; a pad name or v marks a point on that pad's centre or on a via)
+1.8V  (via drill 0.35)
  Top 0.152: C5.1 25.54,1.73 27.33,1.73 27.75,1.73 | 27.75,1.73 C14.1 31.25,1.79 32.47,3.01 v32.62,3.01 | 56.77,3.68 C15.2 55.06,8.75 52.19,11.62 C13.1 49.03,11.64 46.68,13.99 | 56.77,3.68 R1.1 | 56.77,3.68 58.87,5.78 C20.2 | U1.13 42.27,12.57 42.27,11.2 | 42.27,11.2 41.87,11.2 40.62,9.95 U4.5 40.44,9.93 39.46,8.96 v38.56,8.96 | 42.27,11.2 43.88,11.2 46.68,13.99 | U1.22 43.81,18.41 46.96,18.41 | 46.96,18.41 46.96,16.32 | 46.96,16.32 46.96,15.82 | 46.96,15.82 46.96,14.28 46.68,13.99 | 46.96,18.41 46.99,18.43 49.72,18.43 50.32,17.84 50.95,17.84 v51.48,18.37 | C12.2 46.37,25.45 47.25,24.57 50.48,24.57 50.71,24.33 | 50.71,24.33 C4.1 50.71,20.7 v50.95,20.47 | 50.71,24.33 52.16,24.33 53.23,25.4 U2.2 | 46.96,16.32 46.25,15.6 U1.19 | 46.96,15.82 47.12,15.67 48.65,15.67 49.06,15.26 50.25,15.26 50.25,15.87 U3.4 | 1V8.TP 27.75,1.73
  Bottom 0.152: v51.48,18.37 50.95,18.9 v50.95,20.47 | v38.56,8.96 v32.62,3.01
CSB  (via drill 0.35)
  Top 0.152: v57.46,22.98 57,23.44 56.39,23.44 U2.5 | v44.35,12.77 44.35,13.07 43.9,13.53 U1.15
  Bottom 0.152: v57.46,22.98 47.25,12.77 v44.35,12.77
CSB_OUT  (via drill 0.35)
  Top 0.152: v72.09,18.86 v76.05,18.86 | v63.25,22.67 62.49,23.44 62.18,23.44 U2.16 | v84.59,13.23 86.91,13.23 U7.34
  Bottom 0.152: v84.59,13.23 83.83,13.23 83.06,13.99 80.78,13.99 77.12,17.65 77.12,17.8 v76.05,18.86 | v72.09,18.86 67.06,18.86 v63.25,22.67
D+
  Top 0.152: J1.3 87.3,25.54 82.18,25.54 80.1,27.62 67.44,27.62 67.06,27.25 67.06,24.81 68.43,23.44 68.74,23.44 U6.3
D-  (via drill 0.35)
  Top 0.152: v66.33,24.13 67.61,22.85 U6.4 | J1.2 88.02,24.26 88.02,23.36 86.72,22.07 86.11,22.07 85.39,22.78 81.61,22.78 81.45,22.94 81.45,25.23 79.81,26.88 v78.28,26.88
  Bottom 0.152: v66.33,24.13 66.23,24.23 66.23,26.78 66.94,27.48 77.68,27.48 v78.28,26.88
DTR  (via drill 0.35)
  Top 0.152: U6.23 69.96,25.11 69.96,25.57 v69.5,26.03 69.04,26.48 68.13,26.48 DTRT.TP | 82.61,10.02 R3.2 | 82.61,10.02 81.54,8.96 78.03,8.96 76.66,7.59 Q2.2 | v81.23,15.82 82.15,14.9 82.15,10.48 82.61,10.02
  Bottom 0.152: v69.5,26.03 70.11,26.64 73.01,26.64 81.23,18.41 v81.23,15.82
ECGN  (via drill 0.35)
  Top 0.152: R5.2 55.94,13.38 54.26,13.38 C9.1 54.11,13.23 v54.11,12.01 | 38.72,13.38 36.73,11.4 C17.2 | 38.72,13.38 38.87,13.53 U1.7 | 38.72,13.38 v39.17,12.92
  Bottom 0.152: v54.11,12.01 44.35,12.01 43.9,11.55 40.54,11.55 v39.17,12.92
ECGP
  Top 0.152: U1.6 35.17,14.1 C10.1 35.06,14.14 34.75,13.84 34.75,11.4 C17.1 34.6,11.4 32.92,11.4 R4.2
EN  (via drill 0.35)
  Top 0.152: v91.86,7.85 91.76,7.76 R2.1 | v49.23,2.4 EN.TP | v80.47,2.1 79.56,2.1 R6.1 | v92.74,4.84 92.74,3.02 C3.2 | Q1.3 78.74,13.57 v78.74,12.14 | v77,11.53 77,10.04 77.38,9.65 77.38,9.04 77.16,8.82 76.75,8.82 75.61,7.67 75.61,6.7 76.36,5.95 v77.2,5.95 | U7.9 94.42,16.19 94.92,15.69 v94.92,15.43
  Bottom 0.152: v49.23,2.4 75.6,2.4 75.75,2.56 75.77,2.53 | 77.92,5.54 80.16,7.78 82.04,7.78 83.52,6.3 89.68,6.3 90.72,7.34 91.34,7.34 v91.86,7.85 | 75.77,2.53 78.17,4.93 78.17,5.29 77.92,5.54 | v80.47,2.1 77.12,2.1 76.97,1.95 76.36,1.95 75.77,2.53 | v92.74,4.84 92.74,6.96 v91.86,7.85 | v78.74,12.14 78.13,11.53 v77,11.53 | 77.92,5.54 77.52,5.95 v77.2,5.95 | v94.92,15.43 94.92,10.92 v91.86,7.85
FCLK  (via drill 0.35)
  Top 0.152: v51.97,22.37 52.43,22.83 56.24,22.83 U2.6 | v49.3,17.81 49.3,16.57 U3.3 | v43.59,12.16 43.44,12.16 42.98,12.62 U1.14
  Bottom 0.152: v49.3,17.81 49.73,18.24 49.73,20.59 51.52,22.37 v51.97,22.37 52.58,22.98 52.58,23.59 52.28,23.89 51.67,23.89 51.37,23.59 51.37,23.25 43.59,15.48 v43.59,12.16
GND  (via drill 0.35)
  Top 0.152: U1.12 41.91,14.21 41.89,14.23 41.92,14.29 41.92,14.6 U1.THERMAL | 10.67,15.36 10.22,15.36 U5.2 10.67,15.36 | 10.67,15.36 11.13,14.9 11.13,14.14 10.37,13.38 7.47,13.38 6.71,12.62 C24.2 | 10.67,15.36 10.67,15.66 11.13,16.12 v11.13,18.65 11.13,19.63 11.47,19.96 GNDT.TP | 18.29,26.48 20.27,24.5 G1.- | U2.11 62.03,20.08 58.07,20.08 57.77,19.78 56.24,19.78 v56.24,19.47 | 48.93,22.98 C4.2 48.77,23.13 45.27,23.13 44.96,23.44 C12.1 | 37.5,23.89 33.23,23.89 32.47,23.13 31.86,23.13 LED1.C | C12.1 44.81,23.59 44.51,23.89 43.9,23.89 43.9,26.18 44.05,26.33 45.88,26.33 46.03,26.18 48.47,26.18 C11.1 | 37.5,23.89 37.5,26.94 37.19,27.25 26.22,27.25 23.48,24.5 20.43,24.5 G1.- | C15.1 53.04,3.78 49.84,3.78 48.77,4.84 C6.2 48.62,5 48.62,7.54 | 46.49,10.94 46.34,10.79 | 48.62,7.54 v48.62,8.2 48.62,8.81 46.49,10.94 | 46.49,10.94 C8.2 | R12.1 8.69,10.02 8.69,7.28 9.46,6.52 10.52,6.52 11.74,7.74 11.74,9.26 12.81,10.33 13.87,10.33 14.03,10.48 15.76,10.48 16.02,10.22 v16.02,8.41 16.02,8.21 17.78,6.45 19.12,6.45 20.73,4.83 20.73,4.39 C22.1 | 39.02,16.12 39.02,16.58 U1.1 39.02,16.73 39.78,17.49 U1.28 | 39.02,14.6 39.02,15.05 U1.4 39.02,15.21 39.02,15.51 U1.3 39.02,15.66 39.02,16.12 | 39.78,14.45 39.63,14.6 39.02,14.6 | 39.78,14.45 39.94,14.29 39.94,12.77 U1.8 | 39.02,14.6 U1.5 | 39.02,16.12 U1.2 38.87,16.12 32.77,16.12 | 41,15.66 41,15.51 U1.THERMAL | 41,15.66 41,16.58 | 41,16.58 41,17.49 U1.26 | 41,16.58 41.61,16.58 41.92,16.88 41.92,17.49 U1.24 41.91,18.63 v42.04,18.76 | 41,16.58 U1.THERMAL | 41,15.66 39.78,14.45 | 41,15.66 U1.THERMAL | 32.77,17.65 32.77,16.12 | 32.77,16.12 32.77,14.75 C10.2 32.62,14.6 32.01,13.99 32.01,6.21 32.47,5.76 37.43,5.76 v38.01,6.34 38.01,6.62 39.24,7.85
  Top 0.152: 32.77,17.65 33.53,18.41 C7.2 | 32.77,17.65 31.1,19.32 29.88,19.32 C23.2 29.72,19.32 29.42,19.02 | 39.78,8.35 39.79,8.34 | 39.78,8.35 39.24,8.35 39.24,7.85 | 39.24,7.85 39.24,7.75 | C14.2 27.26,3.62 v27.14,3.51 26.56,4.09 C5.2 | 36.12,2.56 C2.2 36.28,2.56 39.48,2.56 39.63,2.71 C16.1 39.78,2.71 40.24,2.25 42.98,2.25 R9.1 43.13,2.25 43.13,2.71 v43.74,3.32 | 50.45,16.43 50.45,16.73 U3.2 50.45,16.88 50.45,17.04 50.76,17.34 v53.04,17.34 | 49.08,13.38 C13.2 49.3,13.24 52.27,13.24 | C20.1 56.85,7.59 56.85,7.79 52.28,12.36 52.28,13.23 52.27,13.24 | 52.27,13.24 C9.2 | 52.13,13.38 C9.2 | S2.1 84.28,7.13 88.25,7.13 S2.2 88.4,7.13 v89.31,8.04 | 90.07,1.95 C3.1 89.87,1.74 v87.48,1.74 87.35,1.87 C19.2 | 84.89,1.95 C19.2 | 84.74,1.95 C19.2 | U6.25 70.72,23.13 70.11,23.74 68.89,23.74 U6.2 68.74,23.89 68.43,23.89 68.13,24.2 v68.13,25.42 | 78.27,23.59 80.17,23.59 S3.2 80.32,23.44 | 78.27,23.59 76.21,23.59 S3.1 | v90.65,22.3 92.33,22.3 92.57,22.54 | v86.42,22.67 85.96,23.13 85.96,24.27 J1.5 | 92.57,22.54 R13.2 | v81.23,14.9 81.23,13.23 C18.1 | U4.2 41.2,7.61 41.2,8.33 41.18,8.35 39.78,8.35 | C12.1 v41.67,23.55 | v41.67,23.55 | 37.5,23.89 41.33,23.89 v41.67,23.55 | C9.2 52.35,13.29 53.91,14.85 v54.72,14.85 | 78.27,23.59 78.72,24.04 v78.72,25.07 | GNDT1.TP 48.73,7.66 48.62,7.54 | 92.57,22.54 93.86,23.83 GNDT2.TP | U7.49 89.15,16.2 v89.15,16.49 | U7.49 91.91,16.45 v91.94,16.45 | U7.49 90.4,14.68 v89.24,13.52 | U7.49 92.06,13.28 v92.18,13.28 | G1.- 17.89,26.85 v11.78,26.85
  Bottom 0.152: 53.5,17.34 v53.04,17.34 | v43.74,3.32 v48.62,8.2 51.82,11.4 54.41,11.4 54.72,11.7 v54.72,14.85 54.72,16.12
  pour Bottom: 0.35,27.99 92.03,27.99 96.02,23.99 96.02,0.54 0.35,0.54
INT2B  (via drill 0.35)
  Top 0.152: v51.52,21.45 56.24,21.45 U2.8 | v46.26,16.62 45.85,16.47 U1.20
  Bottom 0.152: v51.52,21.45 51.06,21.45 50.15,20.54 50.15,17.34 49.43,16.62 v46.26,16.62
INTB  (via drill 0.35)
  Top 0.152: v54.41,22.22 56.24,22.22 U2.7 | v44.51,17.34 43.9,16.73 U1.21
  Bottom 0.152: v54.41,22.22 52.43,24.2 51.37,24.2 v44.51,17.34
INTB_OUT  (via drill 0.35)
  Top 0.152: U7.16 91.65,20.45 v92.12,20.91 | v59.65,21.23 60.78,21.23 61.7,22.15 U2.14
  Bottom 0.152: v92.12,20.91 92.12,26.37 91.27,27.22 80.23,27.22 79.29,26.27 73.8,26.27 73.13,26.94 69.14,26.94 69.14,26.95 68.19,26.95 66.98,25.74 66.98,23.03 65.08,23.03 63.76,24.35 63.76,24.65 59.65,24.65 v59.65,21.23
IO0  (via drill 0.35)
  Top 0.152: 78.8,5.3 78.8,8.35 Q2.3 78.8,8.5 81.54,8.5 82.15,9.11 83.37,9.11 83.98,9.72 83.98,16.04 87.16,19.23 88.02,19.23 88.15,19.1 U7.23 | 78.8,5.3 R8.2 | R14.1 75.88,4.09 v76.12,4.09 | v77.34,5 77.64,5.3 78.8,5.3
  Bottom 0.152: v76.12,4.09 77.03,5 v77.34,5
IO13  (via drill 0.35)
  Top 0.152: v76.66,2.56 74.99,2.56 LED2.A | v89.76,20.98 89.76,20.04 89.65,19.93 U7.20
  Bottom 0.152: v89.76,20.98 91.12,20.98 95.85,16.25 95.85,5.74 92.82,2.71 76.82,2.71 v76.66,2.56
LNA_IN
  Top 0.152: ANT1.1 98.72,5.66 96.27,5.66 96.27,11.44 96.28,11.44 96.28,12.71 | 96.28,12.71 96.28,17.26 93.63,19.9 R10.2 | U7.2 93.89,12.71 96.28,12.71
MISO  (via drill 0.35)
  Top 0.152: U1.18 44.43,15.1 44.53,15.21 45.83,15.21 v46.15,14.89 | U2.1 52.69,26.05 v51.98,25.34 | v46.72,21.23 47.15,21.23 48.61,19.77 54.35,19.77 v55.07,19.04 | v47.63,14.94 49.65,14.94 50.66,13.93 51.11,13.93 52.45,15.27 v52.72,15.27
  Bottom 0.152: v46.15,14.89 47.58,14.89 v47.63,14.94 | v51.98,25.34 50.71,24.07 47.05,24.07 46.72,23.74 v46.72,21.23 | v55.07,19.04 55.07,17.62 v52.72,15.27
MISO_OUT  (via drill 0.35)
  Top 0.152: v86.26,9.41 87.56,9.41 88.15,10.01 U7.38 | v61.12,22.52 60.51,23.13 60.51,24.81 61.73,26.03 62.03,26.03 U2.20
  Bottom 0.152: v86.26,9.41 71.79,9.41 67.21,4.84 66.6,4.84 61.12,10.33 v61.12,22.52
MOSI  (via drill 0.35)
  Top 0.152: v55.18,24.65 56.24,24.65 U2.3 | v45.12,13.38 45.57,13.84 45.57,14.6 45.27,14.9 44.66,14.9 44.35,14.6 43.9,14.6 U1.17
  Bottom 0.152: v55.18,24.65 55.18,21.15 47.4,13.38 v45.12,13.38
MOSI_OUT  (via drill 0.35)
  Top 0.152: v72.85,17.49 v76.51,17.49 | v66.15,21.15 62.64,24.65 62.18,24.65 U2.18 | v85.51,11.28 86.42,12.19 U7.36
  Bottom 0.152: v85.51,11.28 85.31,11.28 82.91,13.68 80.32,13.68 v76.51,17.49 | v72.85,17.49 72.85,19.04 71.35,20.54 66.76,20.54 v66.15,21.15
N$1
  Top 0.152: H1.B5,5 28.2,18.41 30.64,18.41 30.94,18.1 30.94,11.4 R4.1
N$2
  Top 0.152: U1.23 42.53,17.65 42.53,18.26 43.29,19.02 52.28,19.02 57.16,14.14 57.16,10.94 59.75,8.35 59.75,3.78 58.68,2.71 58.68,1.64 58.53,1.49 51.06,1.49 48.62,3.93 47.86,3.93 46.95,4.84 C6.1
N$3
  Top 0.152: U1.9 40.39,12.62 40.39,12.01 39.63,11.24 38.41,11.24 35.67,8.5 32.77,8.5 32.31,8.04 32.31,6.37 32.62,6.06 33.99,6.06 35.06,7.13 C1.1
N$4
  Top 0.152: H2.B5,5 65.99,13.38 57.92,13.38 R5.1
N$5  (via drill 0.35)
  Top 0.152: v57.46,20.39 57.31,20.24 56.39,20.24 U2.10 | v60.05,8.96 60.05,2.56 59.9,2.4 R1.2
  Bottom 0.152: v57.46,20.39 57.46,11.55 v60.05,8.96
N$6
  Top 0.152: U1.10 40.85,12.62 40.85,12.01 39.78,10.94 38.56,10.94 35.82,8.2 34.3,8.2 33.38,7.28 C1.2
N$7  (via drill 0.35)
  Top 0.152: U1.11 41.41,12.1 39.14,9.83 38.48,9.83 37.03,8.38 v37.03,6.37 | C2.1 35.86,4.01 v36.92,4.01
  Bottom 0.152: v37.03,6.37 37.03,4.12 v36.92,4.01
N$8
  Top 0.152: R3.1 79.21,10.02 78.9,10.34 Q1.1
N$9
  Top 0.152: VSD.TP 85.25,16.56 85.88,17.19 U7.26
N$11
  Top 0.152: R7.1 75.6,10.33 76.51,9.41 Q2.1
N$12
  Top 0.152: R10.1 95.43,19.75 95.65,19.53 96.24,19.53
N$13  (via drill 0.35)
  Top 0.152: S2.4 88.25,5.45 84.28,5.45 S2.3 83.13,5.44 v82.75,5.06 | v81,7.09 80.67,6.76 R8.1 80.44,4.84 80.17,4.84 79.41,4.08 77.27,4.08 74.53,6.82 74.53,15.82 75.14,16.43 81.54,16.43 83.09,14.87 C18.2
  Bottom 0.152: v81,7.09 81,6.81 v82.75,5.06
N$14  (via drill 0.35)
  Top 0.152: U1.27 40.41,18.55 37.32,18.55 v37.17,18.4 | v44.6,8.24 45.44,9.07 C8.1
  Bottom 0.152: v37.17,18.4 37.17,13.06 39.73,10.5 43.95,10.5 44.6,9.85 v44.6,8.24
N$15  (via drill 0.35)
  Top 0.152: v44.66,3.32 44.81,3.17 44.81,2.25 R9.2 | v71.48,3.32 72.09,3.32 72.7,2.71 LED2.C
  Bottom 0.152: v71.48,3.32 v44.66,3.32
N$16  (via drill 0.35)
  Top 0.152: v38.11,26.03 41,26.03 LED1T.TP | v35.21,23.13 33.99,23.13 LED1.A | v28.51,16.43 29.49,15.44 29.49,8.45 28.47,8.45 27.81,7.79 R15.1
  Bottom 0.152: v38.11,26.03 v35.21,23.13 v28.51,16.43
N$17
  Top 0.152: U6.9 70.57,21.15 70.57,20.69 71.18,20.08 75.14,20.08 URSTT.TP
N$18  (via drill 0.35)
  Top 0.152: S3.3 76.21,21.91 80.17,21.91 S3.4 80.32,22.07 v84.89,22.07 | v90.98,4.29 92.66,5.98 92.66,6.21 R2.2 | v84.13,3.32 82.76,1.95 C19.1
  Bottom 0.152: v84.13,3.32 85.06,4.25 90.94,4.25 v90.98,4.29 91.08,4.29 92.21,3.17 92.82,3.17 95.53,5.88 95.53,15.98 91.69,19.82 88.57,19.82 88.57,21.9 87.18,23.28 86.11,23.28 v84.89,22.07
N$20
  Top 0.152: R13.1 95.78,21.6 96.3,21.6
N$21
  Top 0.152: S1.2 10.24,24.41 G1.+@1 18.14,20 24.23,20 26.93,22.7 G1.+@2 29.37,24.41 31.31,26.35 V_BATT.TP
N$25
  Top 0.152: R11.1 4.73,16.58 5.19,16.58 7.17,14.6 10.06,14.6 U5.3
N$26  (via drill 0.35)
  Top 0.152: 7.78,16.58 9.91,16.58 10.06,16.43 U5.1 | 7.78,16.58 6.56,16.58 R11.2 | 7.78,7.43 8.08,7.43 9.3,6.21 10.67,6.21 11.44,6.98 | 7.78,7.43 6.86,7.43 D3.C | 11.44,6.98 12.65,8.2 12.65,8.81 U8.2 | C22.2 18.18,5.09 13.32,5.09 11.44,6.98 | v7.78,15.21 7.78,16.58 | 7.78,7.43 v7.78,9.26
  Bottom 0.152: v7.78,9.26 v7.78,15.21
RTS  (via drill 0.35)
  Top 0.152: v73.46,20.69 73.46,24.5 73.01,24.96 72.09,24.96 U6.19 | v75.14,14.6 75.14,14.14 75.44,13.84 Q1.2 75.6,13.68 75.6,12.31 R7.2 | v66.91,5.45 65.39,3.93 RTST.TP
  Bottom 0.152: v73.46,20.69 73.46,16.27 v75.14,14.6 75.14,12.06 72.8,9.72 71.66,9.72 67.39,5.45 v66.91,5.45
RXD  (via drill 0.35)
  Top 0.152: U6.21 71.02,25.11 71.02,25.57 70.57,26.03 71.86,27.32 75.94,27.32 76.39,26.87 RXDT.TP 76.26,25.43 75.12,25.43 74.63,24.94 v74.63,21.87 | v88.42,9.33 89.15,10.07 U7.40
  Bottom 0.152: v88.42,9.33 87.65,10.1 85.82,10.1 84.52,11.4 81.68,11.4 74.63,18.45 v74.63,21.87
SCLK  (via drill 0.35)
  Top 0.152: v51.97,23.28 52.74,24.05 56.24,24.05 U2.4 | v44.96,14.29 44.66,14.29 44.51,14.14 43.9,14.14 U1.16
  Bottom 0.152: v51.97,23.28 44.96,16.27 v44.96,14.29
SCLK_OUT  (via drill 0.35)
  Top 0.152: v84.62,10.35 84.62,11.59 85.73,12.69 U7.35 | v61.12,23.44 61.73,24.05 62.03,24.05 U2.17
  Bottom 0.152: v84.62,10.35 82.28,10.35 74.07,18.56 74.07,21 74.02,21 73.71,21.3 73.21,21.3 72.86,20.94 72.66,20.74 72.56,20.84 67.32,20.84 66.4,21.76 65.9,21.76 65.82,21.68 65.16,21.68 63.4,23.44 v61.12,23.44
TXD  (via drill 0.35)
  Top 0.152: U6.20 71.63,25.11 71.63,25.57 72.24,26.18 72.55,25.87 v72.85,25.87 73.42,26.44 TXDT.TP | U7.41 89.65,9.41 v89.61,9.37
  Bottom 0.152: v89.61,9.37 89.38,9.37 84.45,14.29 80.93,14.29 77.42,17.8 77.42,21.3 v72.85,25.87
V_BATT  (via drill 0.35)
  Top 0.152: U8.3 14.78,7.75 VBATST.TP 13.1,6.32 v12.45,6.98 | S1.1 6.76,24.27 3.59,21.09 3.59,9.16 4.21,8.54 v4.36,8.54
  Bottom 0.152: v4.36,8.54 10.88,8.54 v12.45,6.98
V_USB  (via drill 0.35)
  Top 0.152: D3.A 10.03,8.13 11.89,9.99 | 11.89,9.99 U8.1 12.75,11.6 13.48,12.34 14.88,12.34 14.88,19.4 14.91,19.43 25.57,19.43 27.5,21.36 27.5,21.51 36.62,21.51 37.33,20.8 37.33,19.4 37.35,19.38 53.05,19.38 54.93,17.5 VUSBT.TP 61.3,17.5 63.66,19.87 v68.69,19.87 | J1.1 88.6,23.18 88.6,23.12 83.58,18.1 71.94,18.1 v70.28,19.76 70.09,19.95 70.09,21.14 U6.8 | R12.2 11.76,10.13 11.89,9.99
  Bottom 0.152: v68.69,19.87 70.17,19.87 v70.28,19.76
VCM
  Top 0.152: C7.1 36.01,19.01 40.94,19.01 41.46,18.48 41.46,17.56 U1.25
VDD
  Top 0.152: U5.5 12.56,16.48 13.96,16.48 13.96,13.07 13.86,12.96 9.05,12.96 C24.1 6.67,9.51 5.68,8.52 5.68,7.13 8.04,4.76 16.93,4.76 17.59,4.1 17.59,3.09 18.28,2.4 22.91,2.4 23.26,2.74 23.26,5.61 23.38,5.73 26.34,5.73 27.87,4.2 27.87,4.13 29.61,5.86 R15.2 30.28,6.21 | C16.2 40.62,5.47 U4.1 | 30.28,6.21 31.06,6.21 32.47,4.8 39.61,4.8 C16.2 | C11.2 50.44,26.1 56.26,27.26 64.74,27.26 65.42,26.58 65.42,25.55 65.06,25.19 | 65.06,25.19 64.98,25.11 63.56,25.11 63.27,25.4 U2.19 | 65.06,25.19 65.06,23.75 66.46,22.35 U6.5 U6.6 U6.7 69.56,19.48 73.1,15.94 | 73.1,15.94 74.1,14.94 74.1,7.29 73.26,6.45 R14.2 72.43,4.09 70.5,4.09 70.19,3.77 70.19,1.16 | C16.2 42.52,4.63 | 42.52,4.63 U4.3 | U4.3 | 42.52,4.63 44.21,4.63 46.17,2.67 46.17,1.15 58.83,1.15 66.98,1.16 | 70.19,1.16 76.64,1.16 R6.2 77.61,3.4 77.91,3.7 81.18,3.7 81.84,4.36 81.84,7.59 82.93,8.68 84.51,8.68 | 70.19,1.16 66.98,1.16 | C23.1 30.28,16.95 30.28,6.21 | 73.1,15.94 74.05,16.89 83.87,16.89 88.57,21.59 90.02,21.59 90.6,21 90.73,21 | 92.78,9.44 92.02,8.68 90.87,8.68 | 92.78,9.44 94.35,11.02 94.35,11.7 U7.1 | 84.51,8.68 90.87,8.68 | U7.46 92.15,10.07 92.78,9.44 | U7.43 90.65,8.89 90.87,8.68 | U7.37 86.81,10.63 86.32,10.63 84.51,8.82 84.51,8.68 | U7.19 90.15,20.43 90.73,21 | U7.3 U7.4 95.52,13.69 95.64,13.81 95.64,17.12 93.48,19.28 92.98,19.28 92.98,21.36 92.6,21.75 91.47,21.75 90.73,21 | 66.98,1.16 66.98,2.03 VDDT.TP
(copper drawn outside any net)
  shapes: Top area x12

### Text on the board
tNames: YB,RB,FM